# EAGLE schematic wifilight-leds-cheaper (EAGLE 7.2.0)
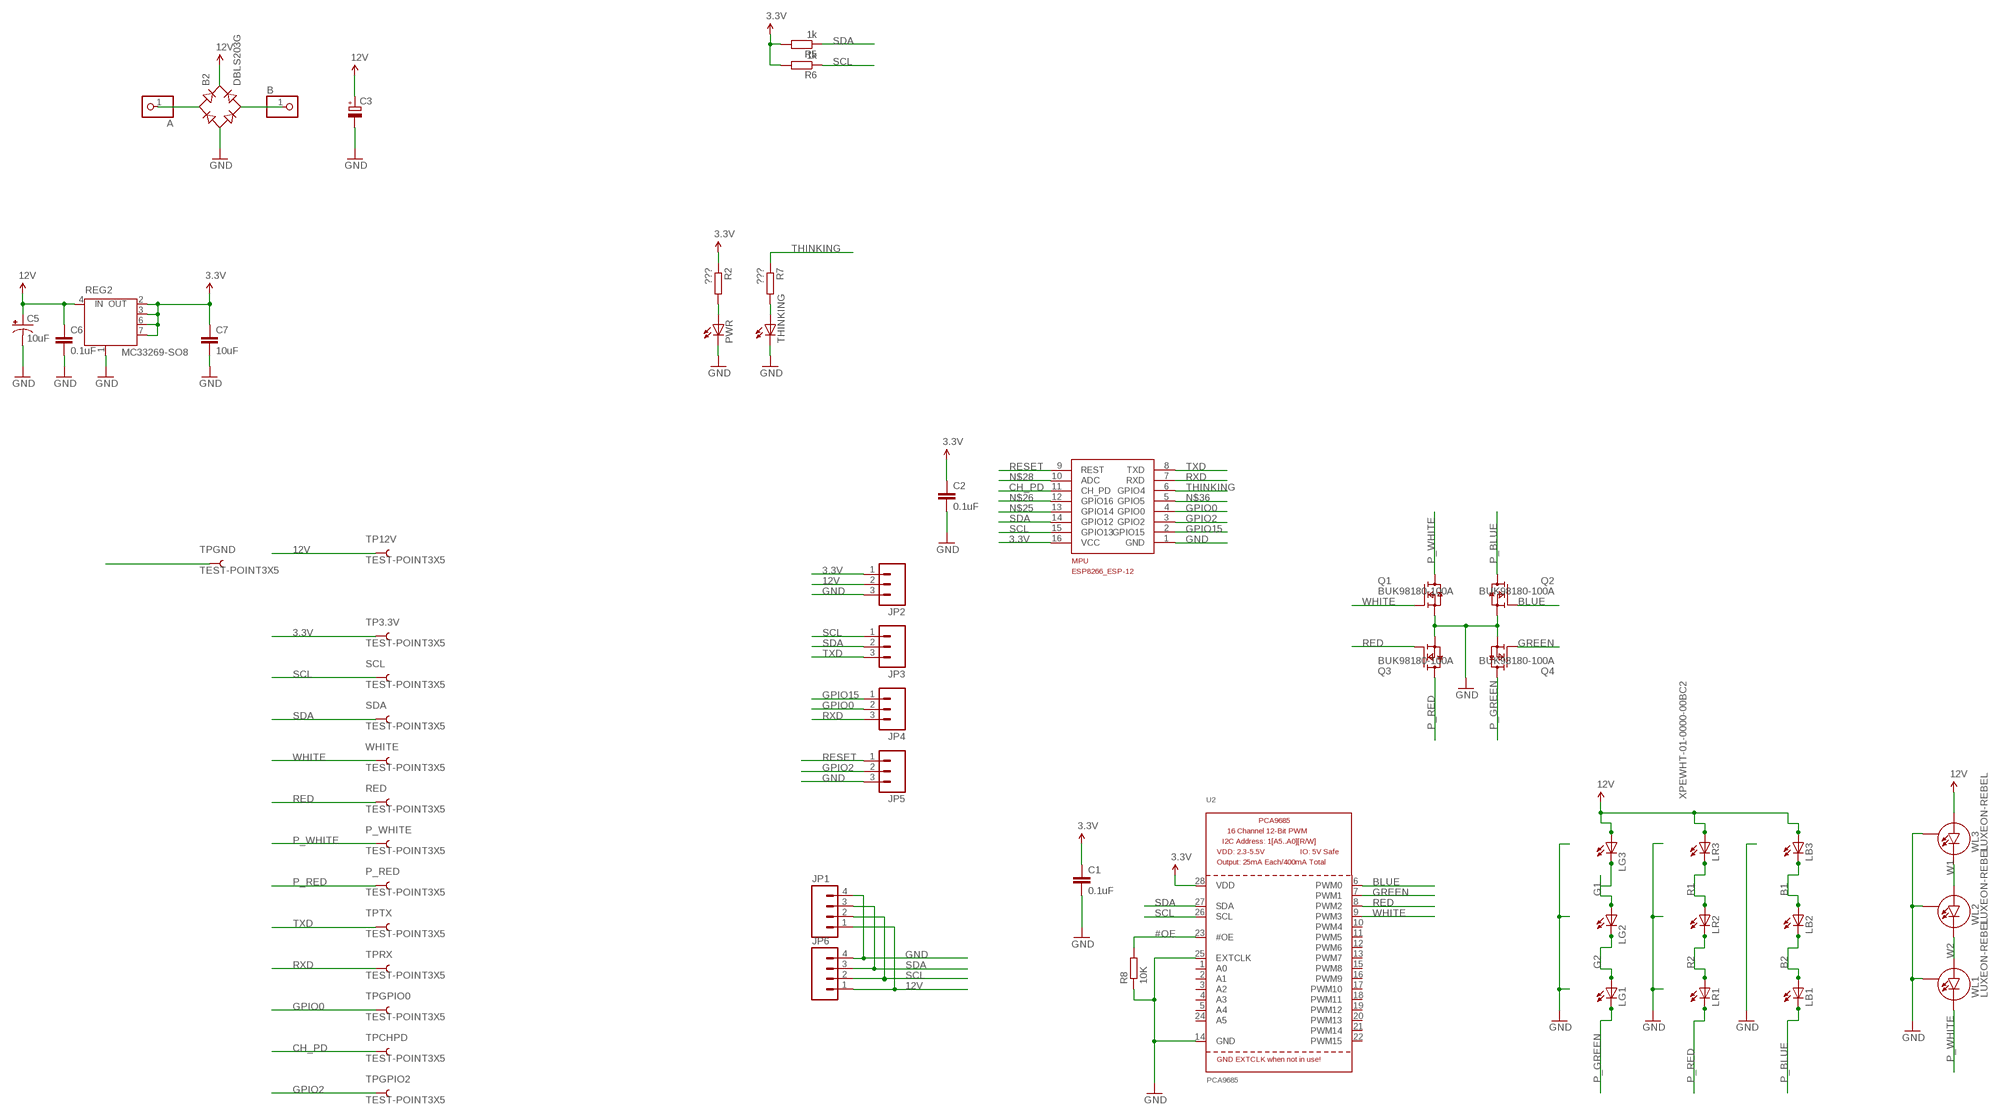
[diagram p0: schematic, sheet 1]

## Parts
A  PINHD-1X1  [1X01]
B  PINHD-1X1  [1X01]
B2  DBLS203G  [DBS]
C1  0.1uF  C-EUC0805K  [C0805K]
C2  0.1uF  C-EUC0805K  [C0805K]
C3  CPOL-EUE3.5-8  [E3,5-8]
C5  10uF  10UF-16V-10%(TANT)  [EIA3216]
C6  0.1uF  C-EUC0805K  [C0805K]
C7  10uF  C-EUC0805K  [C0805K]
JP1  M04JST  [1X04-1.5MM_JST]
JP2  M03LOCK_NO_SILK  [1X03_LOCK_NO_SILK]
JP3  M03LOCK_NO_SILK  [1X03_LOCK_NO_SILK]
JP4  M03LOCK_NO_SILK  [1X03_LOCK_NO_SILK]
JP5  M03LOCK_NO_SILK  [1X03_LOCK_NO_SILK]
JP6  M04JST  [1X04-1.5MM_JST]
LB1  XPEWHT-01-0000-00BC2  [CREE_XLAMP]
LB2  XPEWHT-01-0000-00BC2  [CREE_XLAMP]
LB3  XPEWHT-01-0000-00BC2  [CREE_XLAMP]
LG1  XPEWHT-01-0000-00BC2  [CREE_XLAMP]
LG2  XPEWHT-01-0000-00BC2  [CREE_XLAMP]
LG3  XPEWHT-01-0000-00BC2  [CREE_XLAMP]
LR1  XPEWHT-01-0000-00BC2  [CREE_XLAMP]
LR2  XPEWHT-01-0000-00BC2  [CREE_XLAMP]
LR3  XPEWHT-01-0000-00BC2  [CREE_XLAMP]
MPU  ESP8266_ESP-12  [ESP8266-ESP12]
P_RED  TEST-POINT3X5  [PAD.03X.05]
P_WHITE  TEST-POINT3X5  [PAD.03X.05]
PWR  LEDCHIP-LED0805  [CHIP-LED0805]
Q1  BUK98180-100A  [SOT223]
Q2  BUK98180-100A  [SOT223]
Q3  BUK98180-100A  [SOT223]
Q4  BUK98180-100A  [SOT223]
R2  ???  R-EU_R0805  [R0805]
R5  1k  R-EU_R0805  [R0805]
R6  1k  R-EU_R0805  [R0805]
R7  ???  R-EU_R0805  [R0805]
R8  10K  R-EU_R0805  [R0805]
RED  TEST-POINT3X5  [PAD.03X.05]
REG2  MC33269-SO8  [SO08]
SCL  TEST-POINT3X5  [PAD.03X.05]
SDA  TEST-POINT3X5  [PAD.03X.05]
THINKING  LEDCHIP-LED0805  [CHIP-LED0805]
TP3.3V  TEST-POINT3X5  [PAD.03X.05]
TP12V  TEST-POINT3X5  [PAD.03X.05]
TPCHPD  TEST-POINT3X5  [PAD.03X.05]
TPGND  TEST-POINT3X5  [PAD.03X.05]
TPGPIO0  TEST-POINT3X5  [PAD.03X.05]
TPGPIO2  TEST-POINT3X5  [PAD.03X.05]
TPRX  TEST-POINT3X5  [PAD.03X.05]
TPTX  TEST-POINT3X5  [PAD.03X.05]
U2  PCA9685  [TSSOP28]
WHITE  TEST-POINT3X5  [PAD.03X.05]
WL1  LUXEON-REBEL  [LUXEON-REBEL]
WL2  LUXEON-REBEL  [LUXEON-REBEL]
WL3  LUXEON-REBEL  [LUXEON-REBEL]

## Nets
3.3V: C1.1 C2.1 C7.1 JP2.1 MPU.16(VCC) R2.1 R5.2 R6.2 REG2.2(OUT) REG2.3(OUT) REG2.6(OUT) REG2.7(OUT) TP3.3V.P$1 U2.28(VDD)
12V: B2.+ C3.+ C5.A(+) C6.1 JP1.1 JP2.2 JP6.1 LB3.A LB3.A@1(A) LG3.A LG3.A@1(A) LR3.A LR3.A@1(A) REG2.4(IN) TP12V.P$1 WL3.ANODE(A)
#OE: R8.2 U2.23(#OE)
B1: LB2.A LB2.A@1(A) LB3.C LB3.C@1(C)
B2: LB1.A LB1.A@1(A) LB2.C LB2.C@1(C)
BLUE: Q2.1(G) U2.6(PWM0)
CH_PD: MPU.11(CH_PD) TPCHPD.P$1
G1: LG2.A LG2.A@1(A) LG3.C LG3.C@1(C)
G2: LG1.A LG1.A@1(A) LG2.C LG2.C@1(C)
GND: B2.- C1.2 C2.2 C3.- C5.C(-) C6.2 C7.2 JP1.4 JP2.3 JP5.3 JP6.4 MPU.1(GND) PWR.C Q1.3(S) Q2.3(S) Q3.3(S) Q4.3(S) R8.1 REG2.1(GND/ADJ) THINKING.C TPGND.P$1 U2.14(GND) U2.25(EXTCLK) WL1.P$3(S) WL2.P$3(S) WL3.P$3(S)
GPIO0: JP4.2 MPU.4(GPIO0) TPGPIO0.P$1
GPIO2: JP5.2 MPU.3(GPIO2) TPGPIO2.P$1
GPIO15: JP4.1 MPU.2(GPIO15)
GREEN: Q4.1(G) U2.7(PWM1)
N$14: PWR.A R2.2
N$15: R7.2 THINKING.A
N$18: A.1 B2.AC1
N$19: B2.AC2 B.1
N$25: MPU.13(GPIO14)
N$26: MPU.12(GPIO16)
N$28: MPU.10(ADC)
N$36: MPU.5(GPIO5)
P_BLUE: LB1.C LB1.C@1(C) Q2.2(D) Q2.4(D)
P_GREEN: LG1.C LG1.C@1(C) Q4.2(D) Q4.4(D)
P_RED: LR1.C LR1.C@1(C) P_RED.P$1 Q3.2(D) Q3.4(D)
P_WHITE: P_WHITE.P$1 Q1.2(D) Q1.4(D) WL1.CATHODE(C)
R1: LR2.A LR2.A@1(A) LR3.C LR3.C@1(C)
R2: LR1.A LR1.A@1(A) LR2.C LR2.C@1(C)
RED: Q3.1(G) RED.P$1 U2.8(PWM2)
RESET: JP5.1 MPU.9(REST)
RXD: JP4.3 MPU.7(RXD) TPRX.P$1
SCL: JP1.2 JP3.1 JP6.2 MPU.15(GPIO13) R6.1 SCL.P$1 U2.26(SCL)
SDA: JP1.3 JP3.2 JP6.3 MPU.14(GPIO12) R5.1 SDA.P$1 U2.27(SDA)
THINKING: MPU.6(GPIO4) R7.1
TXD: JP3.3 MPU.8(TXD) TPTX.P$1
W1: WL2.ANODE(A) WL3.CATHODE(C)
W2: WL1.ANODE(A) WL2.CATHODE(C)
WHITE: Q1.1(G) U2.9(PWM3) WHITE.P$1
Unconnected: U2.1(A0) U2.2(A1) U2.3(A2) U2.4(A3) U2.5(A4) U2.10(PWM4) U2.11(PWM5) U2.12(PWM6) U2.13(PWM7) U2.15(PWM8) U2.16(PWM9) U2.17(PWM10) U2.18(PWM11) U2.19(PWM12) U2.20(PWM13) U2.21(PWM14) U2.22(PWM15) U2.24(A5)

## Library data of the parts
A B = adafruit:PINHD-1X1: Pin header 1x1 for 0.1" spacing With round pins
B2 = rectifier:DB?*G: Single Phase 1.0 AMP Glass Passivated Bridge Rectifier Taiwan Semiconductor Co.,Ltd. - TSC Source: http://www.taiwansemi.com/TSCbig5/ezcatfiles/cust/img/img/db101g.pdf http://www.ts.com.tw/db/pictures/modules/PDT/PDT060207001/DBLS201G.pdf
C1 C2 C6 C7 = resistor:C-EU: CAPACITOR, European symbol
C3 = rcl:CPOL-EU: POLARIZED CAPACITOR, European symbol
C5 = SparkFun-Capacitors:10UF-16V-10%(TANT): CAP-00811 1206/EIA-3216 Tantalum capacitor; PROD_ID: CAP-00811
JP1 JP6 = SparkFun-Connectors:M04: Header 4 Standard 4-pin 0.1" header. Use with straight break away headers (SKU : PRT-00116), right angle break away headers (PRT-00553), swiss pins (PRT-00743), machine pins (PRT-00117), and female headers (PRT-00115). Molex polarized connector foot print use with SKU : PRT-08231 with associated crimp pins and housings. 1MM SMD Version SKU: PRT-10208
JP2-JP5 = SparkFun-Connectors:M03: Header 3 Standard 3-pin 0.1" header. Use with straight break away headers (SKU : PRT-00116), right angle break away headers (PRT-00553), swiss pins (PRT-00743), machine pins (PRT-00117), and female headers (PRT-00115). Molex polarized connector foot print use with SKU : PRT-08232 with associated crimp pins and housings.
LB1-LB3 LG1-LG3 LR1-LR3 = led:XPEWHT-: Cree® XLamp® XP-E LEDs Source: www.cree.com/xlamp .. XLampXP-E.pdf
MPU = ESP8266-ESP12:ESP8266_ESP-12
P_RED P_WHITE RED SCL SDA TP3.3V TP12V TPCHPD TPGND TPGPIO0 TPGPIO2 TPRX TPTX WHITE = SparkFun-Passives:TEST-POINT: Bare copper test points for troubleshooting or ICT
PWR THINKING = led:LED: LED OSRAM: - CHIPLED LG R971, LG N971, LY N971, LG Q971, LY Q971, LO R971, LY R971 LH N974, LH R974 LS Q976, LO Q976, LY Q976 LO Q996 - Hyper CHIPLED LW Q18S LB Q993, LB Q99A, LB R99A - SideLED LS A670, LO A670, LY A670, LG A670, LP A670 LB A673, LV A673, LT A673, LW A673 LH A674 LY A675 LS A676, LA A676, LO A676, LY A676, LW A676 LS A679, LY A679, LG A679 - Hyper Micro SIDELED® LS Y876, LA Y876, LO Y876, LY Y876 LT Y87S - SmartLED LW L88C, LW L88S LB L89C, LB L89S, LG L890 LS L89K, LO L89K, LY L89K LS L896, LA L896, LO L896, LY L896 - TOPLED LS T670, LO T670, LY T670, LG T670, LP T670 LSG T670, LSP T670, LSY T670, LOP T670, LYG T670 LG T671, LOG T671, LSG T671 LB T673, LV T673, LT T673, LW T673 LH T674 LS T676, LA T676, LO T676, LY T676, LB T676, LH T676, LSB T676, LW T676 LB T67C, LV T67C, LT T67C, LS T67K, LO T67K, LY T67K, LW E67C LS E67B, LA E67B, LO E67B, LY E67B, LB E67C, LV E67C, LT E67C LW T67C LS T679, LY T679, LG T679 LS T770, LO T770, LY T770, LG T770, LP T770 LB T773, LV T773, LT T773, LW T773 LH T774 LS E675, LA E675, LY E675, LS T675 LS T776, LA T776, LO T776, LY T776, LB T776 LHGB T686 LT T68C, LB T68C - Hyper Mini TOPLED® LB M676 - Mini TOPLED Santana® LG M470 LS M47K, LO M47K, LY M47K Source: http://www.osram.convergy.de LUXEON: - LUMILED® LXK2-PW12-R00, LXK2-PW12-S00, LXK2-PW14-U00, LXK2-PW14-V00 LXK2-PM12-R00, LXK2-PM12-S00, LXK2-PM14-U00 LXK2-PE12-Q00, LXK2-PE12-R00, LXK2-PE12-S00, LXK2-PE14-T00, LXK2-PE14-U00 LXK2-PB12-K00, LXK2-PB12-L00, LXK2-PB12-M00, LXK2-PB14-N00, LXK2-PB14-P00, LXK2-PB14-Q00 LXK2-PR12-L00, LXK2-PR12-M00, LXK2-PR14-Q00, LXK2-PR14-R00 LXK2-PD12-Q00, LXK2-PD12-R00, LXK2-PD12-S00 LXK2-PH12-R00, LXK2-PH12-S00 LXK2-PL12-P00, LXK2-PL12-Q00, LXK2-PL12-R00 Source: www.luxeon.com KINGBRIGHT: KA-3528ASYC Source: www.kingbright.com
Q1-Q4 = nxp_60:BUK98180-100A: N-channel TrenchMOS logic level FET Logic level N-channel enhancement mode Field-Effect Transistor (FET) in a plastic package using TrenchMOS technology. This product has been designed and qualified to the appropriate AEC standard for use in automotive critical applications. AAL Eindhoven MK
R2 R5-R8 = resistor:R-EU_: RESISTOR, European symbol
REG2 = linear:MC33269-SO8: Adjustable Output Low Dropout Voltage Regulator 800 mA Source: http://www.onsemi.com/pub/Collateral/MC33269-D.PDF
U2 = adafruit:PCA9685: PCA9685 - 16 Channel 12-Bit I2C PWM Controller 5.0V tolerant 16 channel, 12-bit I2C PWM controller with 25mA per output (max. 400mA total) Digikey: 568-5931-1-ND
WL1-WL3 = SparkFun-LED:LUXEON-REBEL: Luxeon Rebel single-color high output LED